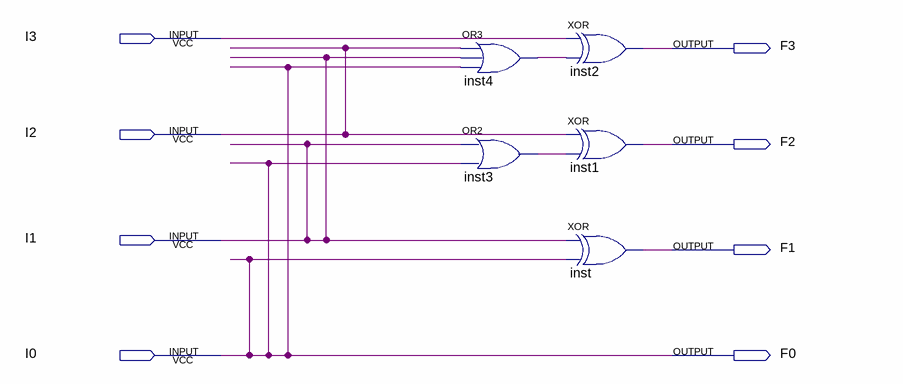
[diagram p0: schematic sheet]
// Quartus schematic inversor.bdf as structural Verilog: 5 symbols, 8 pins
module inversor (
  input  I3,
  input  I2,
  input  I1,
  input  I0,
  output F3,
  output F2,
  output F1,
  output F0
);

  wire inst3_out, inst4_out;

  or inst4 (inst4_out, I2, I1, I0);
  or inst3 (inst3_out, I1, I0);
  xor inst2 (F3, I3, inst4_out);
  xor inst1 (F2, I2, inst3_out);
  xor inst (F1, I1, I0);

  assign F0 = I0;
endmodule
